# EAGLE schematic sensorboard (EAGLE 6.4)
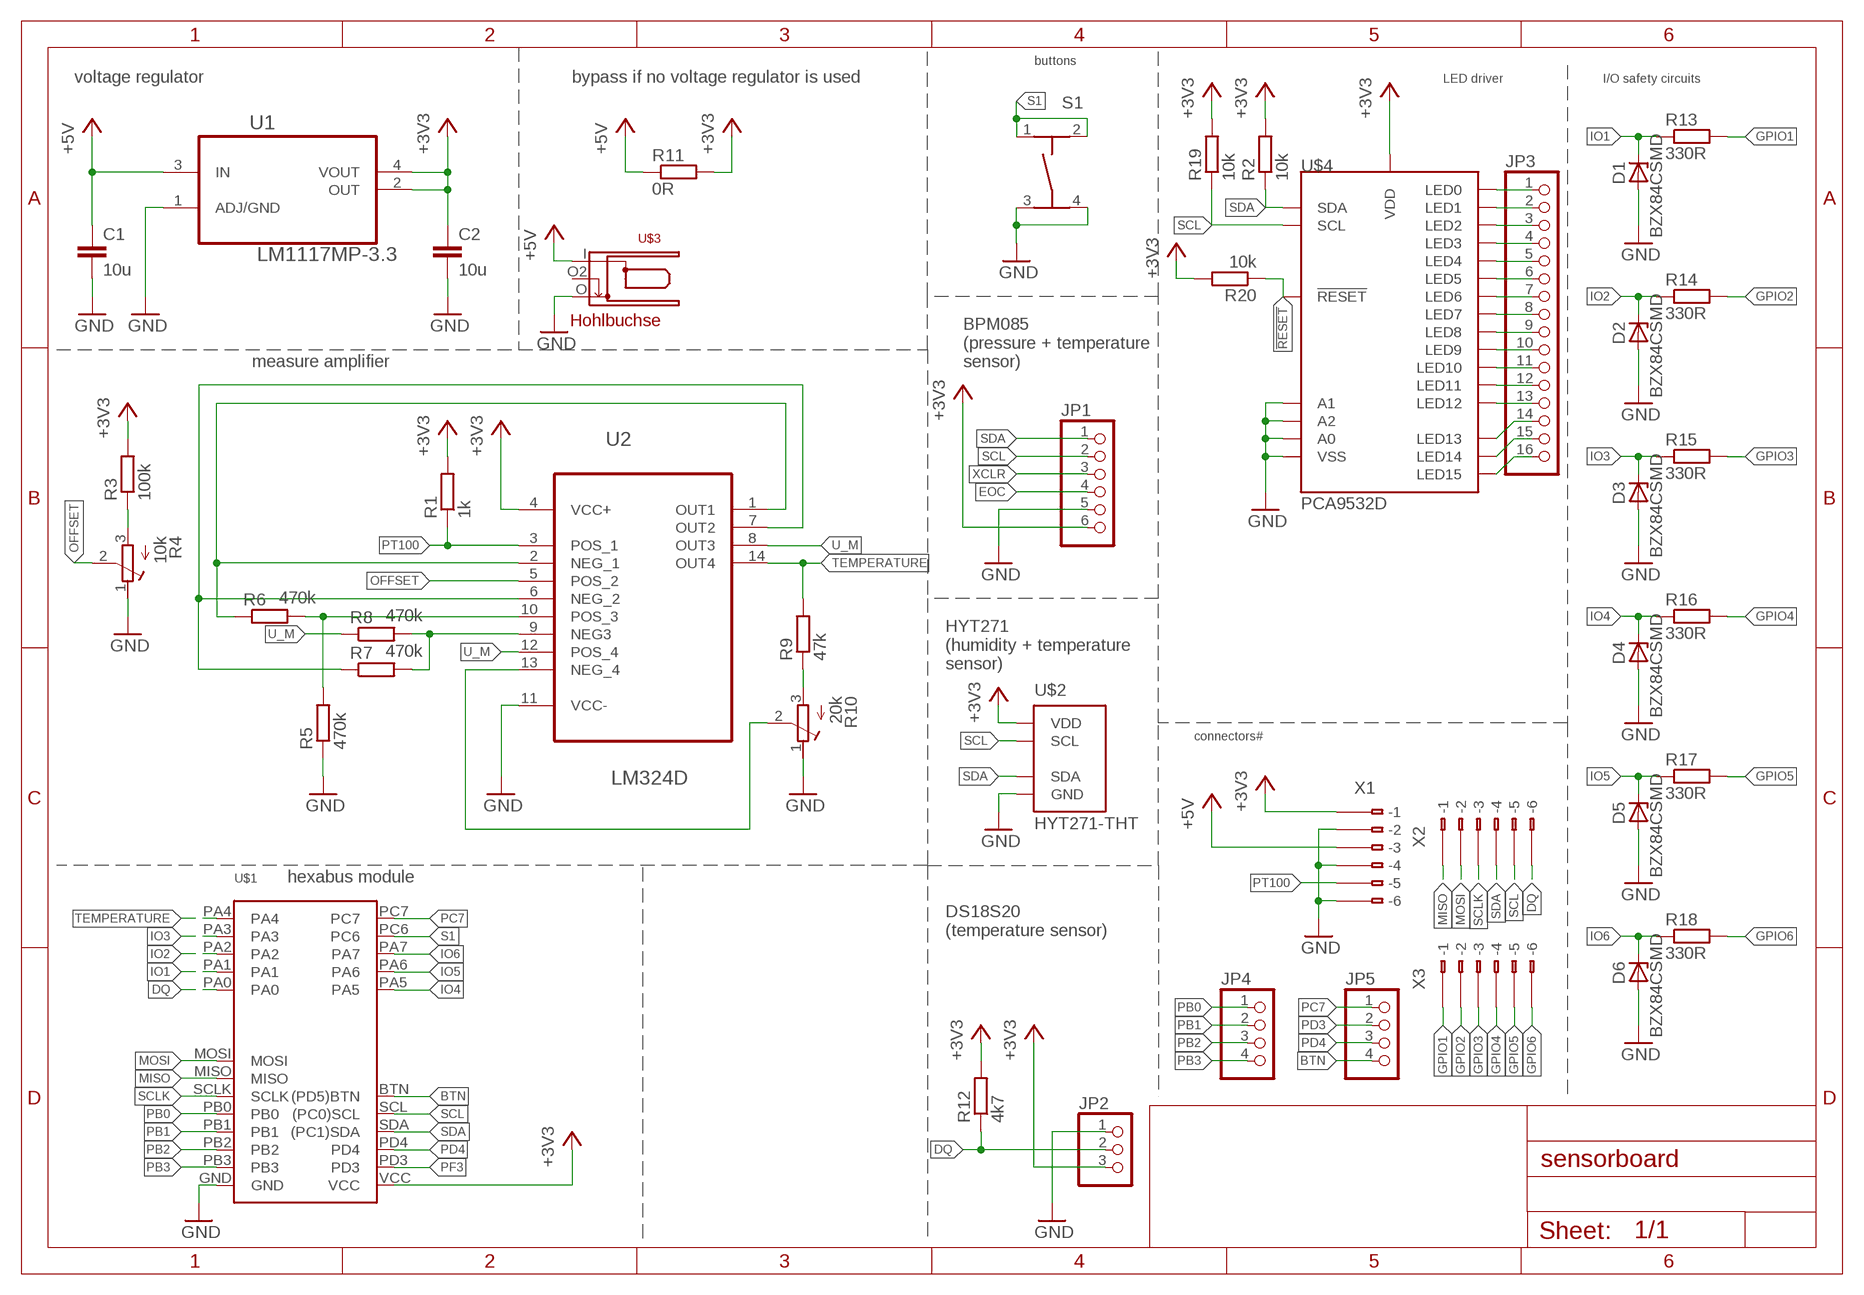
[diagram p0: schematic, sheet 1]

## Parts
C1  10u  C-EUC0805  [C0805]
C2  10u  C-EUC0805  [C0805]
D1  BZX84CSMD  [TO236]
D2  BZX84CSMD  [TO236]
D3  BZX84CSMD  [TO236]
D4  BZX84CSMD  [TO236]
D5  BZX84CSMD  [TO236]
D6  BZX84CSMD  [TO236]
JP1  PINHD-1X6  [1X06]
JP2  PINHD-1X3  [1X03]
JP3  PINHD-1X16  [1X16]
JP4  PINHD-1X4  [1X04]
JP5  PINHD-1X4  [1X04]
R1  1k  R-EU_R0805  [R0805]
R2  10k  R-EU_R0805  [R0805]
R3  100k  R-EU_R0805  [R0805]
R4  10k  R-TRIMMT93YB  [RTRIMT93YB]
R5  470k  R-EU_R0805  [R0805]
R6  470k  R-EU_R0805  [R0805]
R7  470k  R-EU_R0805  [R0805]
R8  470k  R-EU_R0805  [R0805]
R9  47k  R-EU_R0805  [R0805]
R10  20k  R-TRIMMT93YB  [RTRIMT93YB]
R11  0R  R-EU_R0805  [R0805]
R12  4k7  R-EU_R0805  [R0805]
R13  330R  R-EU_R0805  [R0805]
R14  330R  R-EU_R0805  [R0805]
R15  330R  R-EU_R0805  [R0805]
R16  330R  R-EU_R0805  [R0805]
R17  330R  R-EU_R0805  [R0805]
R18  330R  R-EU_R0805  [R0805]
R19  10k  R-EU_R0805  [R0805]
R20  10k  R-EU_R0805  [R0805]
S1  TASTER-9314_SMD  [TASTER-9314_SMD]
U1  LM1117MP-3.3  [SOT230P696X180-4N]
U2  LM324D  [SOIC127P600X175-14N]
U$1  HEXABUS  [HEXABUS]
U$2  HYT271-THT  [HYT271-THT]
U$3  HOHLBUCHSE  [HOHLBUCHSE]
U$4  PCA9532D  [SO24]
X1  233-206  [233-206]
X2  233-206  [233-206]
X3  233-206  [233-206]

## Nets
!RESET: R20.1 U$4.P$21(!RESET)
+3V3: C2.1 JP1.6 JP2.3 R1.2 R2.2 R3.2 R11.2 R12.2 R19.2 R20.2 U1.2(OUT) U1.4(VOUT) U2.4(VCC+) U$1.VCC U$2.VDD U$4.P$24(VDD) X1.B1(B-1)
+5V: C1.1 R11.1 U1.3(IN) U$3.I X1.B3(B-3)
BTN: JP5.4 U$1.BTN((PD5)BTN)
DQ: JP2.2 R12.1 U$1.PA0 X2.B6(B-6)
EOC: JP1.4
GND: C1.2 C2.2 D1.A D2.A D3.A D4.A D5.A D6.A JP1.5 JP2.1 R4.1(E) R5.1 R10.1(E) S1.3 S1.4 U1.1(ADJ/GND) U2.11(VCC-) U$1.GND U$2.GND U$3.O U$4.P$1(A0) U$4.P$2(A1) U$4.P$3(A2) U$4.P$12(VSS) X1.B2(B-2) X1.B4(B-4) X1.B6(B-6)
GPIO1: R13.2 X3.B1(B-1)
GPIO2: R14.2 X3.B2(B-2)
GPIO3: R15.2 X3.B3(B-3)
GPIO4: R16.2 X3.B4(B-4)
GPIO5: R17.2 X3.B5(B-5)
GPIO6: R18.2 X3.B6(B-6)
IO1: D1.C R13.1 U$1.PA1
IO2: D2.C R14.1 U$1.PA2
IO3: D3.C R15.1 U$1.PA3
IO4: D4.C R16.1 U$1.PA5
IO5: D5.C R17.1 U$1.PA6
IO6: D6.C R18.1 U$1.PA7
MISO: U$1.MISO X2.B1(B-1)
MOSI: U$1.MOSI X2.B2(B-2)
N$1: R6.1 U2.1(OUT1) U2.2(NEG_1)
N$2: R7.1 U2.6(NEG_2) U2.7(OUT2)
N$3: R5.2 R6.2 U2.10(POS_3)
N$4: R7.2 R8.2 U2.9(NEG3)
N$5: R10.2(S) U2.13(NEG_4)
N$6: R9.1 R10.3(A)
N$7: R3.1 R4.3(A)
N$8: JP3.1 U$4.P$4(LED0)
N$9: JP3.2 U$4.P$5(LED1)
N$10: JP3.3 U$4.P$6(LED2)
N$11: JP3.4 U$4.P$7(LED3)
N$12: JP3.5 U$4.P$8(LED4)
N$13: JP3.6 U$4.P$9(LED5)
N$14: JP3.7 U$4.P$10(LED6)
N$15: JP3.8 U$4.P$11(LED7)
N$16: JP3.9 U$4.P$13(LED8)
N$17: JP3.10 U$4.P$14(LED9)
N$18: JP3.11 U$4.P$15(LED10)
N$19: JP3.12 U$4.P$16(LED11)
N$20: JP3.13 U$4.P$17(LED12)
N$21: JP3.14 U$4.P$18(LED13)
N$22: JP3.15 U$4.P$19(LED14)
N$23: JP3.16 U$4.P$20(LED15)
OFFSET: R4.2(S) U2.5(POS_2)
PB0: JP4.1 U$1.PB0
PB1: JP4.2 U$1.PB1
PB2: JP4.3 U$1.PB2
PB3: JP4.4 U$1.PB3
PC7: JP5.1 U$1.PC7
PD3: JP5.2
PD4: JP5.3 U$1.PD4
PF3: U$1.PD3
PT100: R1.1 U2.3(POS_1) X1.B5(B-5)
S1: S1.1 S1.2 U$1.PC6
SCL: JP1.2 R19.1 U$1.SCL((PC0)SCL) U$2.SCL U$4.P$22(SCL) X2.B5(B-5)
SCLK: U$1.SCLK X2.B3(B-3)
SDA: JP1.1 R2.1 U$1.SDA((PC1)SDA) U$2.SDA U$4.P$23(SDA) X2.B4(B-4)
TEMPERATURE: R9.2 U2.14(OUT4) U$1.PA4
U_M: R8.1 U2.8(OUT3) U2.12(POS_4)
XCLR: JP1.3
Unconnected: U$3.O2 X1.A1(-1) X1.A2(-2) X1.A3(-3) X1.A4(-4) X1.A5(-5) X1.A6(-6) X2.A1(-1) X2.A2(-2) X2.A3(-3) X2.A4(-4) X2.A5(-5) X2.A6(-6) X3.A1(-1) X3.A2(-2) X3.A3(-3) X3.A4(-4) X3.A5(-5) X3.A6(-6)

## Notes on the sheet
- buttons
- voltage regulator | bypass if no voltage regulator is used | LED driver | I/O safety circuits
- measure amplifier
- BPM085
  (pressure + temperature
  sensor)
- HYT271
  (humidity + temperature
  sensor)
- connectors#
- hexabus module
- DS18S20
  (temperature sensor)

## Library data of the parts
C1 C2 = rcl:C-EU: CAPACITOR, European symbol
D1-D6 = diode:BZX84CSMD: Z DIODE
JP1 = pinhead:PINHD-1X6: PIN HEADER
JP2 = pinhead:PINHD-1X3: PIN HEADER
JP3 = pinhead:PINHD-1X16: PIN HEADER
JP4 JP5 = pinhead:PINHD-1X4: PIN HEADER
R1-R3 R5-R9 R11-R20 = rcl:R-EU_: RESISTOR, European symbol
R4 R10 = rcl:R-TRIMM: Trimm resistor
S1 = Ergaenzung:TASTER-9314_SMD
U1 = hexasense:LM1117MP-3.3: Linear regulators; MPN: LM1117MP-3.3; OC_FARNELL: 9778195; OC_NEWARK: 41K3470; PACKAGE: SOT223-3; SUPPLIER: NationalSemiconductor
U2 = hexasense:LM324D: Low power quad operational amplifiers; MPN: LM324D; OC_FARNELL: 1467655; OC_NEWARK: 72K8847; PACKAGE: SOIC-14; SUPPLIER: STMicroelectronics
U$1 = hexabus:HEXABUS
U$2 = humidity:HYT271-THT
U$3 = Ergaenzung:HOHLBUCHSE
U$4 = philips:PCA9532D
X1-X3 = con-wago:233-206: WAGO Cage Clamp; MPN: 233-206; OC_FARNELL: 1283536; OC_NEWARK: 28K9063